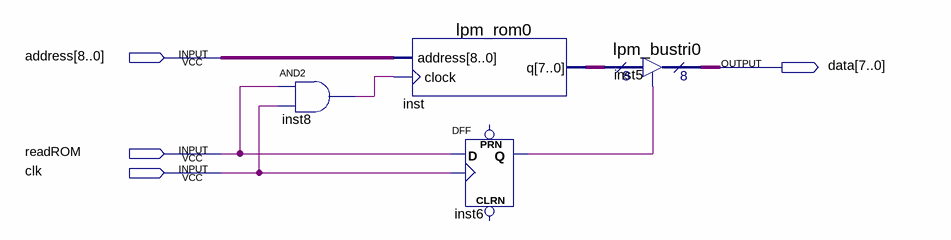
[diagram p0: schematic sheet]
// Quartus schematic ROM.bdf as structural Verilog: 4 symbols, 4 pins
module ROM (
  input  [8:0] address,
  input  readROM,
  input  clk,
  output [7:0] data
);

  wire inst6_q, inst8_out;
  wire [7:0] inst_q;

  and inst8 (inst8_out, readROM, clk);
  lpm_rom0 inst (.address(address), .clock(inst8_out), .q(inst_q));
  DFF inst6 (.CLK(clk), .D(readROM), .Q(inst6_q));  // open: CLRN, PRN
  lpm_bustri0 inst5 (.enabledt(inst6_q), .data(inst_q), .tridata(data));
endmodule
